# EAGLE design rocketBoard (EAGLE 9.2.2)
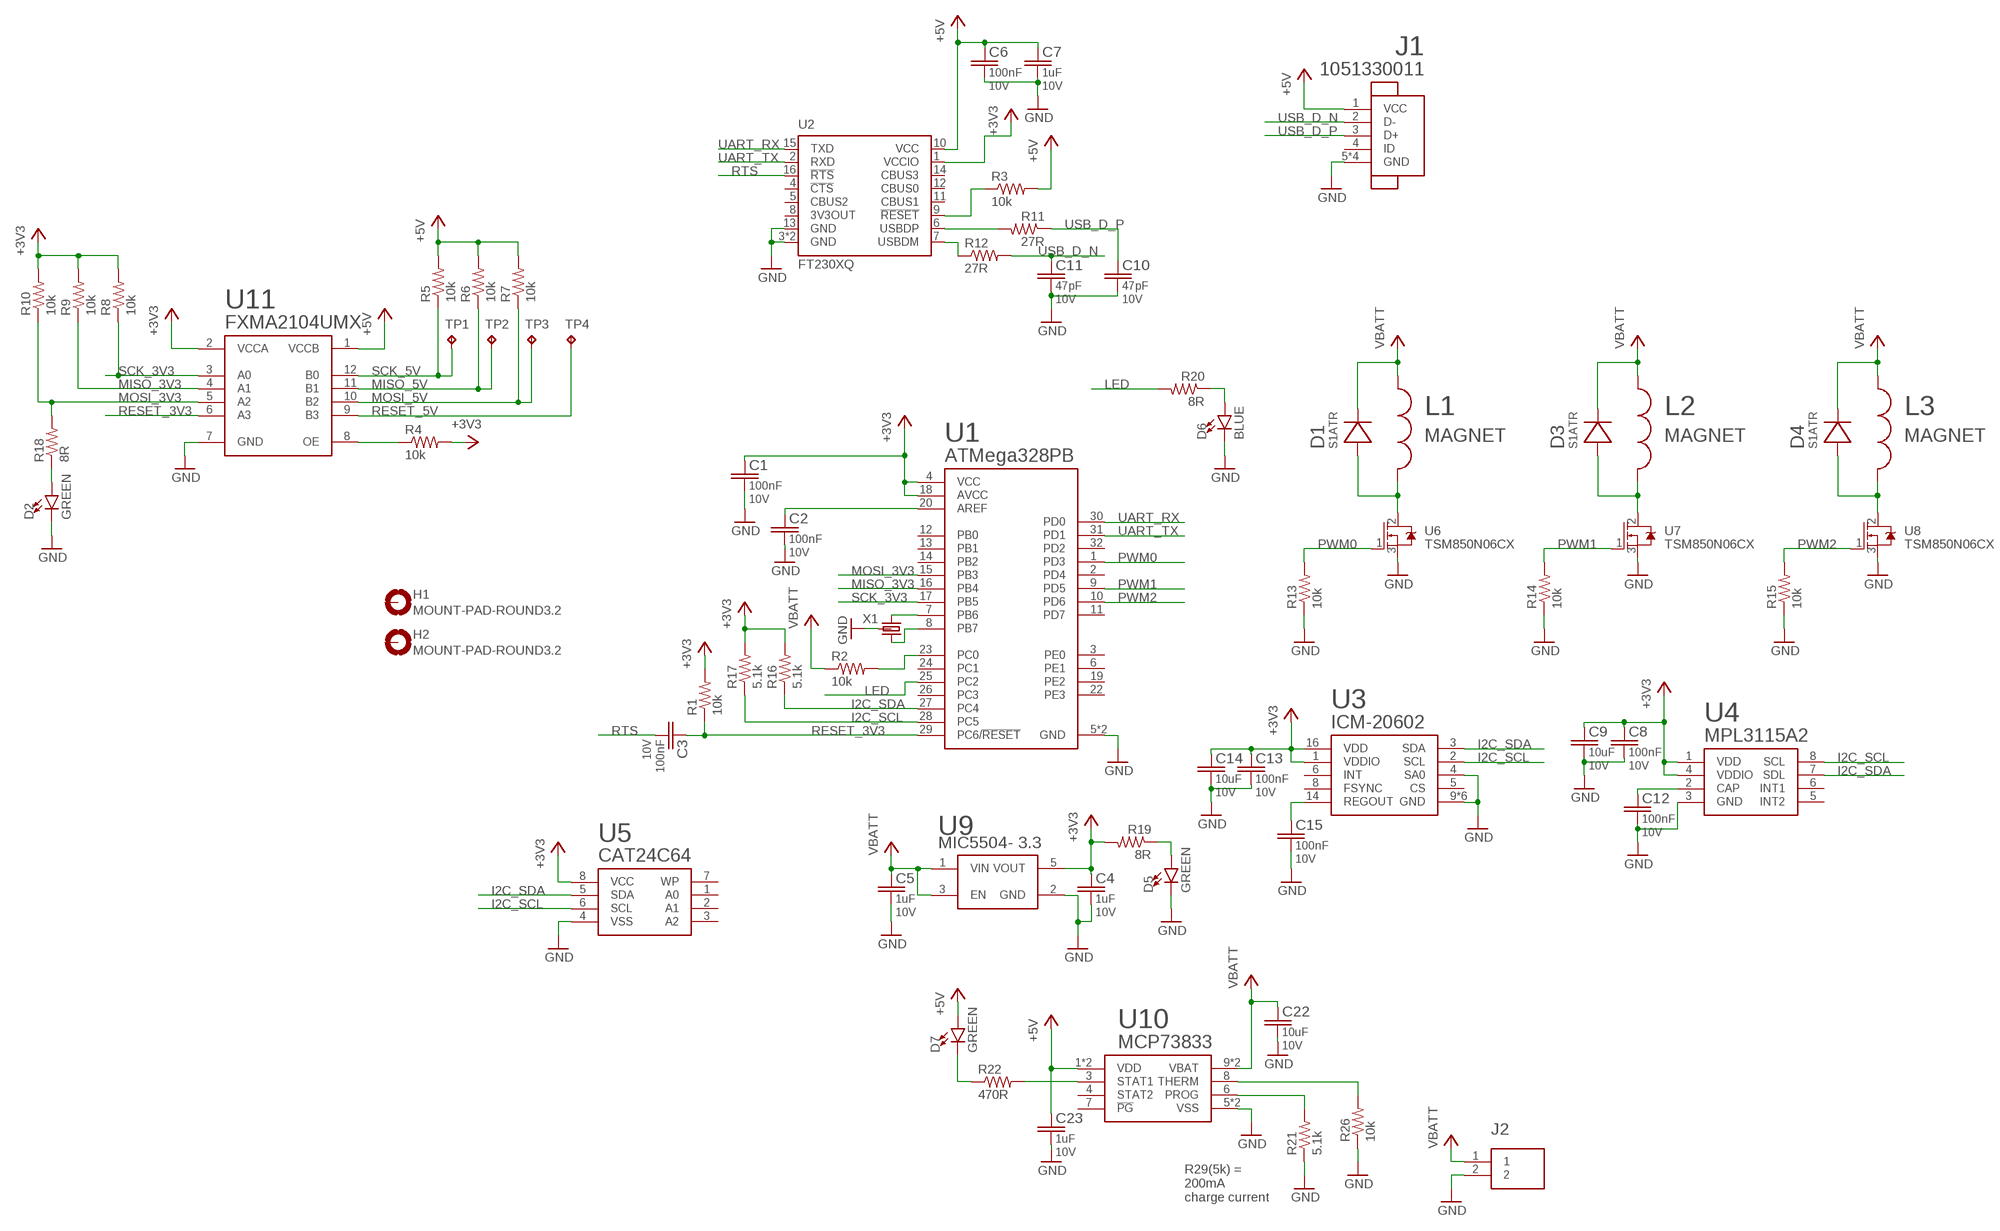
[diagram p0: schematic, sheet 1]

## Parts
C1  100nF  CL05A104MP5NNNC  [C0402]
C2  100nF  CL05A104MP5NNNC  [C0402]
C3  100nF  CL05A104MP5NNNC  [C0402]
C4  1uF  CL05A105MP5NNNC  [C0402]
C5  1uF  CL05A105MP5NNNC  [C0402]
C6  100nF  CL05A104MP5NNNC  [C0402]
C7  1uF  CL05A105MP5NNNC  [C0402]
C8  100nF  CL05A104MP5NNNC  [C0402]
C9  10uF  GRM188R61A106KE69D  [C0603]
C10  47pF  885012005011  [C0402]
C11  47pF  885012005011  [C0402]
C12  100nF  CL05A104MP5NNNC  [C0402]
C13  100nF  CL05A104MP5NNNC  [C0402]
C14  10uF  GRM188R61A106KE69D  [C0603]
C15  100nF  CL05A104MP5NNNC  [C0402]
C22  10uF  GRM188R61A106KE69D  [C0603]
C23  1uF  CL05A105MP5NNNC  [C0402]
D1  S1ATRSMA  [SODFL5226X295]
D2  GREEN  LED-GREEN0603  [LED-0603]
D3  S1ATRSMA  [SODFL5226X295]
D4  S1ATRSMA  [SODFL5226X295]
D5  GREEN  LED-GREEN0603  [LED-0603]
D6  BLUE  LED-GREEN0603  [LED-0603]
D7  GREEN  LED-GREEN0603  [LED-0603]
H1  MOUNT-PAD-ROUND3.2  [3,2-PAD]
H2  MOUNT-PAD-ROUND3.2  [3,2-PAD]
J1  1051330011  [1051330011]
J2  2_PIN_CONNECTOR  [XH_CONNECTOR]
L1  MAGNET  [MAGNET]
L2  MAGNET  [MAGNET]
L3  MAGNET  [MAGNET]
R1  10k  RC0402JR-0710KL  [R0402]
R2  10k  RC0402JR-0710KL  [R0402]
R3  10k  RC0402JR-0710KL  [R0402]
R4  10k  RC0402JR-0710KL  [R0402]
R5  10k  RC0402JR-0710KL  [R0402]
R6  10k  RC0402JR-0710KL  [R0402]
R7  10k  RC0402JR-0710KL  [R0402]
R8  10k  RC0402JR-0710KL  [R0402]
R9  10k  RC0402JR-0710KL  [R0402]
R10  10k  RC0402JR-0710KL  [R0402]
R11  27R  RMCF0402JT27R0  [R0402]
R12  27R  RMCF0402JT27R0  [R0402]
R13  10k  RC0402JR-0710KL  [R0402]
R14  10k  RC0402JR-0710KL  [R0402]
R15  10k  RC0402JR-0710KL  [R0402]
R16  5.1k  RC0402JR-075K1L  [R0402]
R17  5.1k  RC0402JR-075K1L  [R0402]
R18  8R  RMCF0402JT8R20  [R0402]
R19  8R  RMCF0402JT8R20  [R0402]
R20  8R  RMCF0402JT8R20  [R0402]
R21  5.1k  RC0402JR-075K1L  [R0402]
R22  470R  RC0402JR-07470RL  [R0402]
R26  10k  RC0402JR-0710KL  [R0402]
TP1  TPTP20R  [TP20R]
TP2  TPTP20R  [TP20R]
TP3  TPTP20R  [TP20R]
TP4  TPTP20R  [TP20R]
U1  ATMEGA328PBVQFN  [QFN50P500X500X90-32]
U2  FT230XQ  [QFN16]
U3  ICM-20602  [LGA16]
U4  MPL3115A2  [LGA8]
U5  CAT24C64SOIC8  [SOIC127P600X175-8]
U6  TSM850N06CX  TSM850N06CXSOT23  [SOT95P280X110-3]
U7  TSM850N06CX  TSM850N06CXSOT23  [SOT95P280X110-3]
U8  TSM850N06CX  TSM850N06CXSOT23  [SOT95P280X110-3]
U9  3.3  MIC5504-3.3  [SOT23-5]
U10  MCP73833  [DFN10-3X3]
U11  FXMA2104UMX  [12MLP]
X1  CSTCE8M00G55  [3-SMD]

## Nets
+3V3: C1.1 C4.1 C8.1 C9.1 C13.1 C14.1 R1.2 R4.2 R8.2 R9.2 R10.2 R16.2 R17.2 R19.2 U1.4(VCC) U1.18(AVCC) U2.1(VCCIO) U3.1(VDDIO) U3.16(VDD) U4.1(VDD) U4.4(VDDIO) U5.8(VCC) U9.5(VOUT) U11.2(VCCA)
+5V: C6.1 C7.1 C23.1 D7.A J1.1(VCC) R3.2 R5.2 R6.2 R7.2 U2.10(VCC) U10.1(VDD) U10.2(VDD) U11.1(VCCB)
GND: C1.2 C2.2 C4.2 C5.2 C6.2 C7.2 C8.2 C9.2 C10.2 C11.2 C12.2 C13.2 C14.2 C15.2 C22.2 C23.2 D2.C D5.C D6.C J1.5(GND) J1.P$1(GND) J1.P$2(GND) J1.P$3(GND) J2.2 R13.1 R14.1 R15.1 R21.1 R26.1 U1.5(GND) U1.21(GND) U2.3(GND) U2.13(GND) U2.TAB(GND) U3.4(SA0) U3.9(GND) U3.10(GND) U3.11(GND) U3.12(GND) U3.13(GND) U3.15(GND) U4.3(GND) U5.4(VSS) U6.3(S) U7.3(S) U8.3(S) U9.2(GND) U10.5(VSS) U10.EXP(VSS) U11.7(GND) X1.2(GND)
I2C_SCL: R17.1 U1.28(PC5) U3.2(SCL) U4.8(SCL) U5.6(SCL)
I2C_SDA: R16.1 U1.27(PC4) U3.3(SDA) U4.7(SDL) U5.5(SDA)
LED: R20.2 U1.25(PC2)
MISO_3V3: R9.1 U1.16(PB4) U11.4(A1)
MISO_5V: R6.1 TP2.TP U11.11(B1)
MOSI_3V3: R10.1 R18.2 U1.15(PB3) U11.5(A2)
MOSI_5V: R7.1 TP3.TP U11.10(B2)
N$2: R12.1 U2.7(USBDM)
N$3: C2.1 U1.20(AREF)
N$4: R2.2 U1.23(PC0)
N$5: D1.A L1.- U6.2(D)
N$6: D3.A L2.- U7.2(D)
N$7: R3.1 U2.9(!RESET)
N$8: C12.1 U4.2(CAP)
N$9: D4.A L3.- U8.2(D)
N$10: R11.2 U2.6(USBDP)
N$11: U1.8(PB7) X1.3
N$12: U1.7(PB6) X1.1
N$13: C15.1 U3.14(REGOUT)
N$14: D2.A R18.1
N$15: D5.A R19.1
N$16: D6.A R20.1
N$18: R22.2 U10.3(STAT1)
N$19: D7.C R22.1
N$27: R26.2 U10.8(THERM)
N$28: R21.2 U10.6(PROG)
N$36: R4.1 U11.8(OE)
P$1: C5.1 C22.1 D1.C D3.C D4.C J2.1 L1.+ L2.+ L3.+ R2.1 U9.1(VIN) U9.3(EN) U10.9(VBAT) U10.10(VBAT) ; supply symbol labelled VBATT
PWM0: R13.2 U1.1(PD3) U6.1(G)
PWM1: R14.2 U1.9(PD5) U7.1(G)
PWM2: R15.2 U1.10(PD6) U8.1(G)
RESET_3V3: C3.1 R1.1 U1.29(PC6/!RESET) U11.6(A3)
RESET_5V: TP4.TP U11.9(B3)
RTS: C3.2 U2.16(!RTS)
SCK_3V3: R8.1 U1.17(PB5) U11.3(A0)
SCK_5V: R5.1 TP1.TP U11.12(B0)
UART_RX: U1.30(PD0) U2.15(TXD)
UART_TX: U1.31(PD1) U2.2(RXD)
USB_D_N: C11.1 J1.2(D-) R12.2
USB_D_P: C10.1 J1.3(D+) R11.1
Unconnected: H1.B3,2(MOUNT) H2.B3,2(MOUNT) J1.4(ID) U1.2(PD4) U1.3(PE0) U1.6(PE1) U1.11(PD7) U1.12(PB0) U1.13(PB1) U1.14(PB2) U1.19(PE2) U1.22(PE3) U1.24(PC1) U1.26(PC3) U1.32(PD2) U2.4(!CTS) U2.5(CBUS2) U2.8(3V3OUT) U2.11(CBUS1) U2.12(CBUS0) U2.14(CBUS3) U3.5(CS) U3.6(INT) U3.8(FSYNC) U4.5(INT2) U4.6(INT1) U5.1(A0) U5.2(A1) U5.3(A2) U5.7(WP) U10.4(STAT2) U10.7(!PG)

## Notes on the sheet
- R29(5k) =
  200mA 
  charge current

## Library data of the parts
C1-C3 C6 C8 C12 C13 C15 = thanics-capacitor:CL05A104MP5NNNC; RATING: 10V
C4 C5 C7 C23 = thanics-capacitor:CL05A105MP5NNNC; RATING: 10V
C9 C14 C22 = thanics-capacitor:GRM188R61A106KE69D; RATING: 10V
C10 C11 = thanics-capacitor:885012005011; RATING: 10V
D1 D3 D4 = S1ATR:S1ATR
D2 D5 D7 = SparkFun-LED:LED-GREEN: Green SMD LED Used in manufacturing of various products at SparkFun Packages: 0603 - SMD 0603 package [Product Link] <http://www.futureelectronics.com/en/technologies/semiconductors/optoelectronics/leds/Pages/9894312-LTST-C190GKT.aspx?CrossPart=HSMG-C190&IM=0> LilyPad 1206 - SMD1206 LilyPad package [Product Link] <http://www.futureelectronics.com/en/Technologies/Product.aspx?ProductID=IN150NGHARVATEKCORPORATION2049943&IM=0> 1206 - SMD1206 package [Product Link] <http://www.futureelectronics.com/en/technologies/semiconductors/optoelectronics/leds/Pages/8315665-LTST-C150KGKT.aspx?IM=0> 1206 Bottom Mount -SMD 1206 Bottom Mount [Product Link] <http://www.digikey.com/product-detail/en/lite-on-inc/LTST-C230KGKT/160-1456-1-ND/386854> SparkFun Products: Pro Mini 328 -5V <https://www.sparkfun.com/products/821> RedBoard <https://www.sparkfun.com/products/12757> MP3 Trigger <https://www.sparkfun.com/products/13720> Makey Makey <https://www.sparkfun.com/products/11076>; PROD_ID: DIO-00821
D6 = SparkFun-LED:LED-GREEN: Green SMD LED Used in manufacturing of various products at SparkFun Packages: 0603 - SMD 0603 package [Product Link] <http://www.futureelectronics.com/en/technologies/semiconductors/optoelectronics/leds/Pages/9894312-LTST-C190GKT.aspx?CrossPart=HSMG-C190&IM=0> LilyPad 1206 - SMD1206 LilyPad package [Product Link] <http://www.futureelectronics.com/en/Technologies/Product.aspx?ProductID=IN150NGHARVATEKCORPORATION2049943&IM=0> 1206 - SMD1206 package [Product Link] <http://www.futureelectronics.com/en/technologies/semiconductors/optoelectronics/leds/Pages/8315665-LTST-C150KGKT.aspx?IM=0> 1206 Bottom Mount -SMD 1206 Bottom Mount [Product Link] <http://www.digikey.com/product-detail/en/lite-on-inc/LTST-C230KGKT/160-1456-1-ND/386854> SparkFun Products: Pro Mini 328 -5V <https://www.sparkfun.com/products/821> RedBoard <https://www.sparkfun.com/products/12757> MP3 Trigger <https://www.sparkfun.com/products/13720> Makey Makey <https://www.sparkfun.com/products/11076>; PROD_ID: DIO-00821; VALUE: GREEN
H1 H2 = holes:MOUNT-PAD-ROUND: MOUNTING PAD, round
J1 = thanics-connector:1051330011
J2 = thanics_robotics:2_PIN_CONNECTOR
L1-L3 = magnet:MAGNET
R1-R10 R13-R15 R26 = thanics-resistor:RC0402JR-0710KL; TOL: 5%
R11 R12 = thanics-resistor:RMCF0402JT27R0
R16 R17 R21 = thanics-resistor:RC0402JR-075K1L; TOL: 5%
R18-R20 = thanics-resistor:RMCF0402JT8R20; TOL: 5%
R22 = thanics-resistor:RC0402JR-07470RL; TOL: 5%
TP1-TP4 = testpad:TP: Test pad
U1 = atmega328pb:ATMEGA328PB
U2 = ftdichip:FT230X: USB to BASIC UART IC Auto generated by make-symbol-device-package-bsdl.ulp Rev. 43 Source: Data sheet <http://www.ftdichip.com/Support/Documents/DataSheets/ICs/DS_FT230X.pdf>
U3 = icm-20602:ICM-20602
U4 = mpl3115a2:MPL3115A2
U5 = CAT24C64:CAT24C64
U6-U8 = tsm850n06cx:TSM850N06CX
U9 = glasses:MIC5504-3.3
U10 = glasses:MCP73833
U11 = glasses:FXMA2104UMX
X1 = thanics_robotics:CSTCE8M00G55

## Board
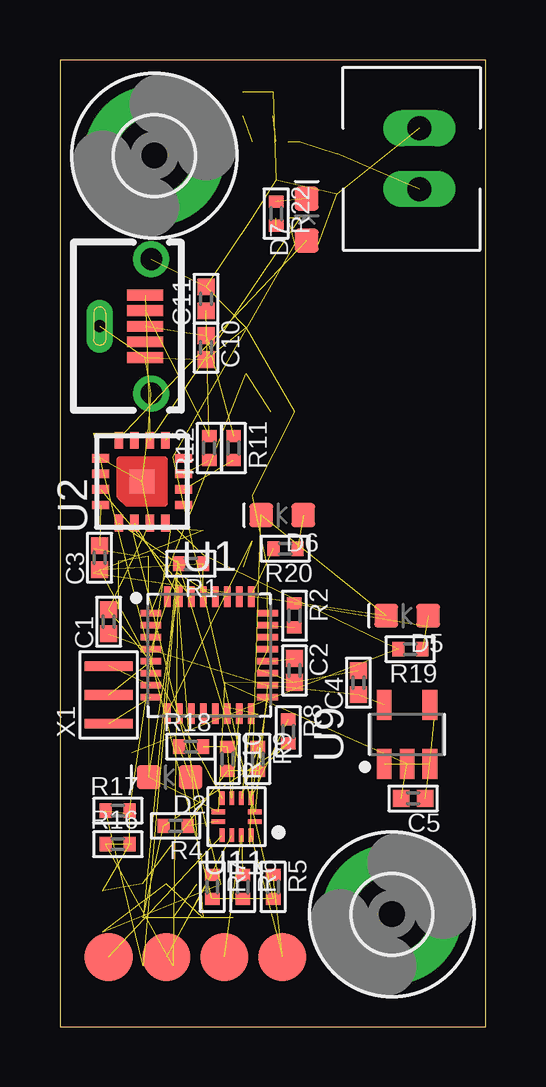
[diagram p1: board, top side]
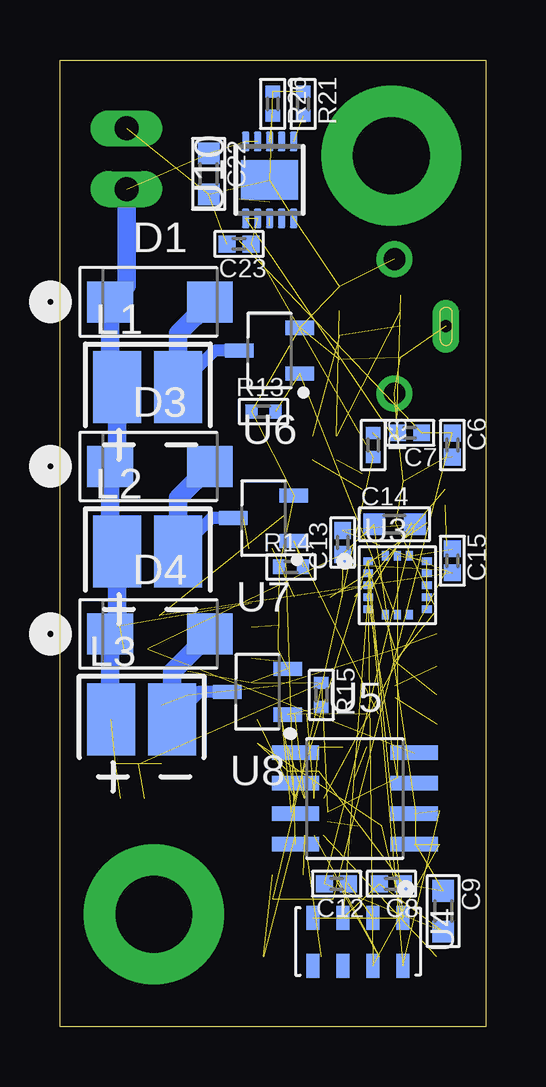
[diagram p2: board, bottom side, seen from below]

Size 17.76 x 40.31 mm. Coordinates in mm from the lower left corner, seen from the top.
Outline: 0,0 17.76,0 17.76,40.31 0,40.31 0,0
Copper layers (1*16): Top 0.035mm / dielectric 0.15mm / Bottom 0.035mm
Design rules "default": minimum track width 6mil, minimum drill 0.35mm, track to track 6mil, track to pad 6mil, pad to pad 6mil, via to via 6mil, smd to smd 6mil, copper to edge 40mil, drill to drill 6mil, minimum pad ring 10mil, minimum via ring 8mil, stop-mask expansion 4mil, vias tented up to drill 0mil, thermal gap 10mil

### Footprints (pad centres in the part's own frame; a part is rotated, then mirrored left to right if it is on the bottom)
C0402 = smd 0.7 x 0.7: 1 -0.5,0; 2 0.5,0
C0603 = smd 0.9 x 0.9: 1 -0.85,0; 2 0.85,0
SODFL5226X295 = smd 1.905 x 1.71: A 2.081,0; C -2.081,0
LED-0603 = smd 1 x 1: A -0.877,0; C 0.877,0
3,2-PAD = drill 3.2 pad 5.842: B3,2 0,0
1051330011 = smd 0.45 x 1.5: 1 -1.3,0; 2 -0.65,0; 3 0,0; 4 0.65,0; 5 1.3,0 | drill 0.5 pad 1.1 long: P$1 0,-1.9 | drill 0.9 pad 1.5: P$2 -2.8,0.25; P$3 2.8,0.25
XH_CONNECTOR = drill 1.001 long: 1 -1.27,0; 2 1.27,0
MAGNET = smd 2 x 3: + -1.27,0; - 1.27,0
R0402 = smd 0.5 x 0.6: 1 -0.5,0; 2 0.5,0
TP20R = smd 2 x 2: TP 0,0
QFN50P500X500X90-32 = smd 0.86 x 0.27: 1 -2.435,1.75; 2 -2.435,1.25; 3 -2.435,0.75; 4 -2.435,0.25; 5 -2.435,-0.25; 6 -2.435,-0.75; 7 -2.435,-1.25; 8 -2.435,-1.75; 17 2.435,-1.75; 18 2.435,-1.25; 19 2.435,-0.75; 20 2.435,-0.25; 21 2.435,0.25; 22 2.435,0.75; 23 2.435,1.25; 24 2.435,1.75 | smd 0.27 x 0.86: 9 -1.75,-2.435; 10 -1.25,-2.435; 11 -0.75,-2.435; 12 -0.25,-2.435; 13 0.25,-2.435; 14 0.75,-2.435; 15 1.25,-2.435; 16 1.75,-2.435; 25 1.75,2.435; 26 1.25,2.435; 27 0.75,2.435; 28 0.25,2.435; 29 -0.25,2.435; 30 -0.75,2.435; 31 -1.25,2.435; 32 -1.75,2.435
QFN16 = smd 0.7 x 0.35: 1 -1.725,0.975; 2 -1.725,0.325; 3 -1.725,-0.325; 4 -1.725,-0.975; 9 1.725,-0.975; 10 1.725,-0.325; 11 1.725,0.325; 12 1.725,0.975 | smd 0.35 x 0.7: 5 -0.975,-1.725; 6 -0.325,-1.725; 7 0.325,-1.725; 8 0.975,-1.725; 13 0.975,1.725; 14 0.325,1.725; 15 -0.325,1.725; 16 -0.975,1.725 | smd 1 x 1: TAB 0,0
LGA16 = smd 0.4 x 0.3: 1 -1.225,1; 2 -1.225,0.5; 3 -1.225,0; 4 -1.225,-0.5; 5 -1.225,-1; 9 1.225,-1; 10 1.225,-0.5; 11 1.225,0; 12 1.225,0.5; 13 1.225,1 | smd 0.3 x 0.4: 6 -0.5,-1.225; 7 0,-1.225; 8 0.5,-1.225; 14 0.5,1.225; 15 0,1.225; 16 -0.5,1.225
LGA8 = smd 1 x 0.55: 1 -1,1.875; 2 -1,0.625; 3 -1,-0.625; 4 -1,-1.875; 5 1,-1.875; 6 1,-0.625; 7 1,0.625; 8 1,1.875
SOIC127P600X175-8 = smd 1.968 x 0.602: 1 -2.473,1.905; 2 -2.473,0.635; 3 -2.473,-0.635; 4 -2.473,-1.905; 5 2.473,-1.905; 6 2.473,-0.635; 7 2.473,0.635; 8 2.473,1.905
SOT95P280X110-3 = smd 1.186 x 0.589: 1 -1.264,0.95; 2 1.264,0; 3 -1.264,-0.95
SOT23-5 = smd 1.259 x 0.609: 1 -1.228,0.95; 2 -1.228,0; 3 -1.228,-0.95; 4 1.228,-0.95; 5 1.228,0.95
DFN10-3X3 = smd 0.8 x 0.3: 1 -1.6,1; 2 -1.6,0.5; 3 -1.6,0; 4 -1.6,-0.5; 5 -1.6,-1; 6 1.6,-1; 7 1.6,-0.5; 8 1.6,0; 9 1.6,0.5; 10 1.6,1 | smd 1.65 x 2.38: EXP 0,0
12MLP = smd 0.563 x 0.2: 1 -0.768,0.2; 2 -0.768,-0.2; 7 0.768,-0.2; 8 0.768,0.2 | smd 0.2 x 0.563: 3 -0.6,-0.768; 4 -0.2,-0.768; 5 0.2,-0.768; 6 0.6,-0.768; 9 0.6,0.768; 10 0.2,0.768; 11 -0.2,0.768; 12 -0.6,0.768
3-SMD = smd 0.4 x 2: 1 1.2,0; 2 0,0; 3 -1.2,0

### Placement (x,y rotation side)
C1  2.03,16.89 90 top
C2  9.78,14.86 270 top
C3  1.65,19.56 90 top
C4  12.45,14.35 90 top
C5  14.73,9.53 180 top
C6  1.4,24.26 270 bottom
C7  3.17,24.77 180 bottom
C8  3.94,5.97 180 bottom
C9  1.78,4.83 270 bottom
C10  6.1,28.32 270 top
C11  6.1,30.35 90 top
C12  6.22,5.97 180 bottom
C13  5.97,20.19 90 bottom
C14  3.81,20.95 0 bottom
C15  1.4,19.43 270 bottom
C22  11.56,35.56 270 bottom
C23  10.29,32.64 180 bottom
D1  13.59,30.23 0 bottom
D2  4.57,10.41 180 top
D3  13.59,23.37 0 bottom
D4  13.59,16.38 0 bottom
D5  14.48,17.14 180 top
D6  9.27,21.34 180 top
D7  10.29,33.66 90 top
H1  3.94,36.32 0 top
H2  13.84,4.7 0 top
J1  3.56,29.21 270 top
J2  14.99,36.2 90 top
L1  14.1,26.67 0 bottom
L2  14.1,19.81 0 bottom
L3  14.35,12.83 0 bottom
R1  5.46,19.3 180 top
R2  9.78,17.14 270 top
R3  4.7,24.26 270 bottom
R4  4.83,8.38 180 top
R5  8.89,5.84 270 top
R6  7.62,5.84 270 top
R7  6.35,5.84 270 top
R8  9.53,12.32 270 top
R9  8.26,11.18 270 top
R10  6.99,11.18 270 top
R11  7.24,24.13 270 top
R12  6.22,24.13 90 top
R13  9.27,25.65 0 bottom
R14  8.13,19.18 0 bottom
R15  6.86,13.84 270 bottom
R16  2.41,7.62 0 top
R17  2.41,9.02 0 top
R18  5.46,11.68 0 top
R19  14.61,15.75 180 top
R20  9.4,19.94 180 top
R21  7.62,38.48 270 bottom
R22  9.02,33.91 270 top
R26  8.89,38.48 270 bottom
TP1  9.27,2.92 0 top
TP2  6.86,2.92 0 top
TP3  4.45,2.92 0 top
TP4  2.03,2.92 0 top
U1  6.22,15.49 0 top
U2  3.43,22.73 90 top
U3  3.68,18.41 0 bottom
U4  5.33,3.56 270 bottom
U5  5.46,9.53 0 bottom
U6  9.02,28.19 180 bottom
U7  9.27,21.21 180 bottom
U8  9.53,13.97 180 bottom
U9  14.48,12.19 90 top
U10  9.02,35.31 90 bottom
U11  7.37,8.76 180 top
X1  2.03,13.84 90 top

### Tracks (layer width: path | path; a pad name or v marks a point on that pad's centre or on a via)
+3V3  (23 unrouted)
+5V  (12 unrouted)
GND  (50 unrouted)
I2C_SCL  (4 unrouted)
I2C_SDA  (4 unrouted)
LED  (1 unrouted)
MISO_3V3  (2 unrouted)
MISO_5V  (2 unrouted)
MOSI_3V3  (3 unrouted)
MOSI_5V  (2 unrouted)
N$2  (1 unrouted)
N$3  (1 unrouted)
N$4  (1 unrouted)
N$5
  Bottom 0.508: U6.2 11.3,28.19 L1.-
  Bottom 0.762: L1.- 12.83,28.91 D1.A
N$6
  Bottom 0.508: U7.2 11.43,21.21 L2.-
  Bottom 0.762: L2.- 12.83,22.05 D3.A
N$7  (1 unrouted)
N$8  (1 unrouted)
N$9
  Bottom 0.508: U8.2 11.94,13.97 L3.-
  Bottom 0.762: L3.- 13.08,14.81 D4.A
N$10  (1 unrouted)
N$11  (1 unrouted)
N$12  (1 unrouted)
N$13  (1 unrouted)
N$14  (1 unrouted)
N$15  (1 unrouted)
N$16  (1 unrouted)
N$18  (1 unrouted)
N$19  (1 unrouted)
N$27  (1 unrouted)
N$28  (1 unrouted)
N$36  (1 unrouted)
P$1  (7 unrouted)
  Bottom 0.762: J2.1 14.99,30.91 D1.C 15.67,26.97 L1.+ 15.37,23.67 D3.C 15.67,20.11 L2.+ 15.37,16.69 D4.C 15.67,12.88 L3.+
PWM0  (2 unrouted)
PWM1  (2 unrouted)
PWM2  (2 unrouted)
RESET_3V3  (3 unrouted)
RESET_5V  (1 unrouted)
RTS  (1 unrouted)
SCK_3V3  (2 unrouted)
SCK_5V  (2 unrouted)
UART_RX  (1 unrouted)
UART_TX  (1 unrouted)
USB_D_N  (2 unrouted)
USB_D_P  (2 unrouted)